# Altium schematic sheet RoomModule.SchDoc
size A4
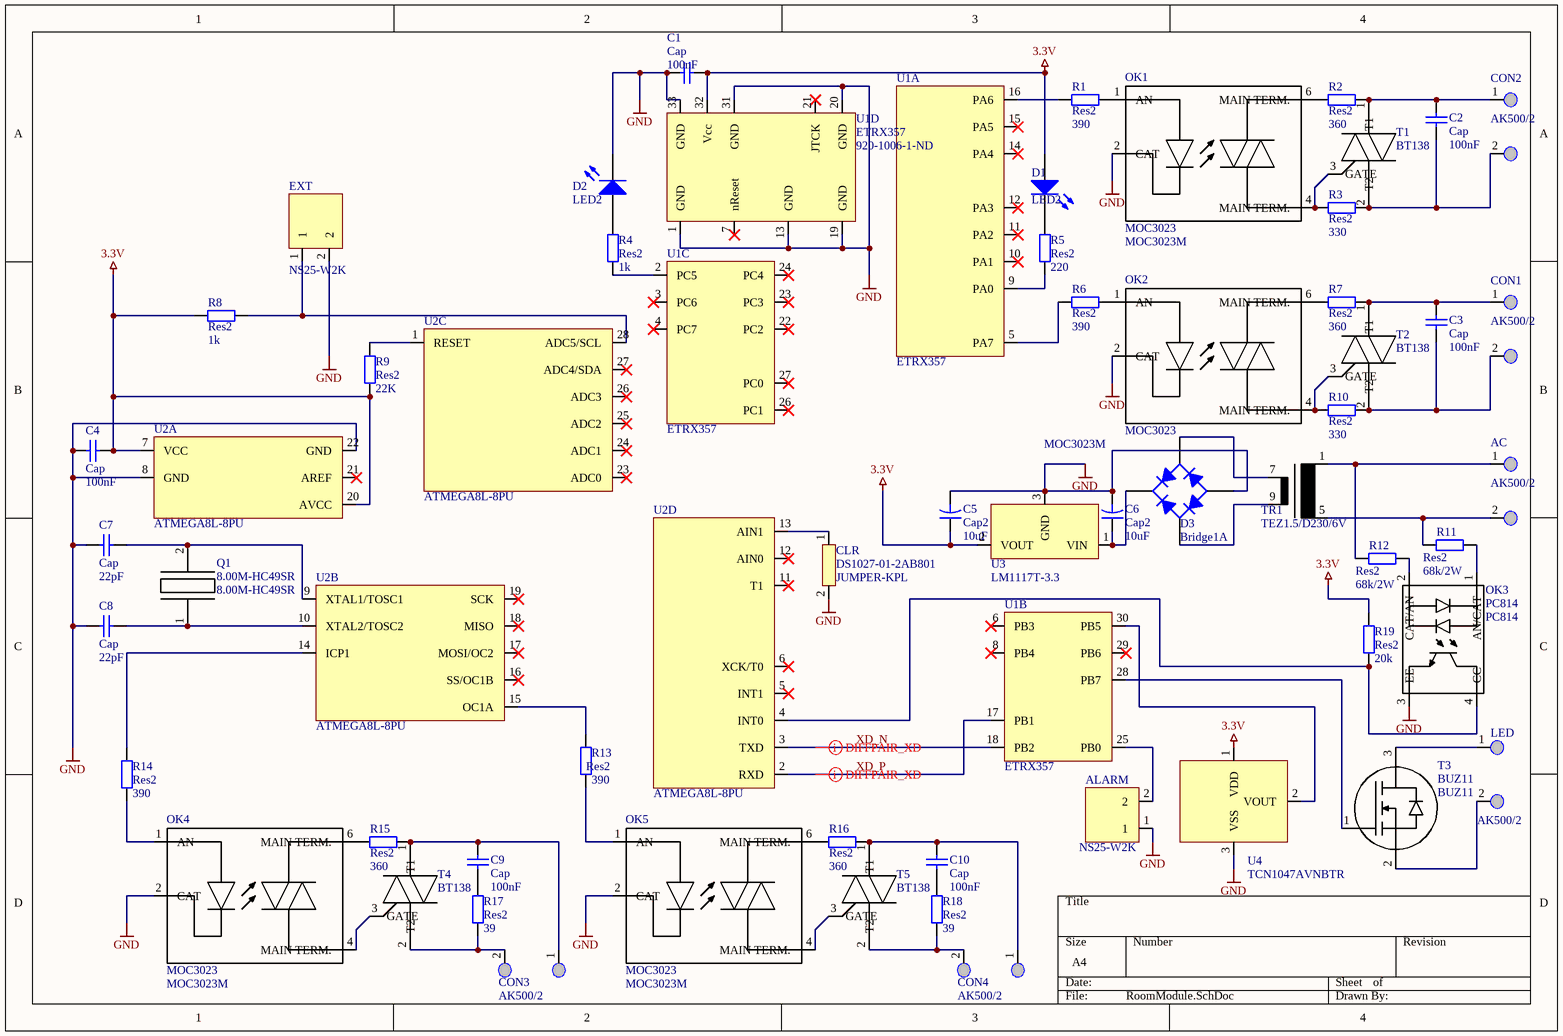
[diagram p0: RoomModule.SchDoc]

## Parts
AC  AK500/2  [AK500/2]
ALARM  NS25-W2K  [NS25-W2K]
C1  Cap  value 100nF  [RAD-0.3]
C2  Cap  value 100nF  [RAD-0.3]
C3  Cap  value 100nF  [RAD-0.3]
C4  Cap  value 100nF  [RAD-0.3]
C5  Cap2  value 10uF  [CAPR5-4X5]
C6  Cap2  value 10uF  [CAPR5-4X5]
C7  Cap  value 22pF  [RAD-0.3]
C8  Cap  value 22pF  [RAD-0.3]
C9  Cap  value 100nF  [RAD-0.3]
C10  Cap  value 100nF  [RAD-0.3]
CLR  DS1027-01-2AB801  Supplier Part Number 1: JUMPER-KPL  [DS1027-01]
CON1  AK500/2  [AK500/2]
CON2  AK500/2  [AK500/2]
CON3  AK500/2  [AK500/2]
CON4  AK500/2  [AK500/2]
D1  LED2  [3.2X1.6X1.1]
D2  LED2  [3.2X1.6X1.1]
D3  Bridge1A  [D-38]
EXT  NS25-W2K  [NS25-W2K]
LED  AK500/2  [AK500/2]
OK1  MOC3023  Supplier Part Number 1: MOC3023M  [DIP6]
OK2  MOC3023  Supplier Part Number 1: MOC3023M  [DIP6]
OK3  PC814  [DIP4]
OK4  MOC3023  Supplier Part Number 1: MOC3023M  [DIP6]
OK5  MOC3023  Supplier Part Number 1: MOC3023M  [DIP6]
Q1  8.00M-HC49SR  [HC49-S]
R1  Res2  value 390  [AXIAL-0.4]
R2  Res2  value 360  [AXIAL-0.4]
R3  Res2  value 330  [AXIAL-0.4]
R4  Res2  value 1k  [AXIAL-0.4]
R5  Res2  value 220  [AXIAL-0.4]
R6  Res2  value 390  [AXIAL-0.4]
R7  Res2  value 360  [AXIAL-0.4]
R8  Res2  value 1k  [AXIAL-0.4]
R9  Res2  value 22K  [AXIAL-0.4]
R10  Res2  value 330  [AXIAL-0.4]
R11  Res2  value 68k/2W  [AXIAL-0.4]
R12  Res2  value 68k/2W  [AXIAL-0.4]
R13  Res2  value 390  [AXIAL-0.4]
R14  Res2  value 390  [AXIAL-0.4]
R15  Res2  value 360  [AXIAL-0.4]
R16  Res2  value 360  [AXIAL-0.4]
R17  Res2  value 39  [AXIAL-0.4]
R18  Res2  value 39  [AXIAL-0.4]
R19  Res2  value 20k  [AXIAL-0.4]
T1  BT138  [TO220AB]
T2  BT138  [TO220AB]
T3  BUZ11  [TO220AB]
T4  BT138  [TO220AB]
T5  BT138  [TO220AB]
TR1  TEZ1.5/D230/6V  [TEZ1.5]
U1  ETRX357  [ETRX3]  (parts A,B,C,D of 4)
U2  ATMEGA8L-8PU  [DIP28_600]  (parts A,B,C,D of 4)
U3  LM1117T-3.3  [TO252]
U4  TCN1047AVNBTR  [SOT23B]

## Nets
3.3V: C1.2 C4.2 C5.1 D1.1(A) R8.2 R9.1 R19.1 U1.32(Vcc) U2.7(VCC) U2.20(AVCC) U3.2(VOUT) U4.1(VDD)
GND: ALARM.1 C1.1 C4.1 C5.2 C6.2 C7.1 C8.1 CLR.2 D2.2(K) D3.3(A) EXT.2 OK1.2(CAT) OK2.2(CAT) OK3.3(EE) OK4.2(CAT) OK5.2(CAT) U1.1(GND) U1.13(GND) U1.19(GND) U1.20(GND) U1.31(GND) U1.33(GND) U2.8(GND) U2.22(GND) U3.3(GND) U4.3(VSS)
XD_N: U1.18(PB2) U2.3(TXD)
XD_P: U1.17(PB1) U2.2(RXD)
NetAC_1: AC.1 R12.2 TR1.1
NetAC_2: AC.2 R11.2 TR1.5
NetALARM_2: ALARM.2 U1.25(PB0)
NetC2_1: C2.1 CON2.2 R3.2 T1.2(T2)
NetC2_2: C2.2 CON2.1 R2.2 T1.1(T1)
NetC3_1: C3.1 CON1.2 R10.2 T2.2(T2)
NetC3_2: C3.2 CON1.1 R7.2 T2.1(T1)
NetC6_1: C6.1 D3.1(K) U3.1(VIN)
NetC7_2: C7.2 Q1.2 U2.9(XTAL1/TOSC1)
NetC8_2: C8.2 Q1.1 U2.10(XTAL2/TOSC2)
NetC9_1: C9.1 R17.1
NetC9_2: C9.2 CON3.1 R15.2 T4.1(T1)
NetC10_1: C10.1 R18.1
NetC10_2: C10.2 CON4.1 R16.2 T5.1(T1)
NetCLR_1: CLR.1 U2.13(AIN1)
NetCON3_2: CON3.2 R17.2 T4.2(T2)
NetCON4_2: CON4.2 R18.2 T5.2(T2)
NetD1_2: D1.2(K) R5.1
NetD2_1: D2.1(A) R4.1
NetD3_2: D3.2(C) TR1.7
NetD3_4: D3.4(C) TR1.9
NetEXT_1: EXT.1 R8.1 U2.28(ADC5/SCL)
NetLED_1: LED.1 T3.3
NetLED_2: LED.2 T3.2
NetOK1_1: OK1.1(AN) R1.2
NetOK1_4: OK1.4(MAIN_TERM.) R3.1 T1.3(GATE)
NetOK1_6: OK1.6(MAIN_TERM.) R2.1
NetOK2_1: OK2.1(AN) R6.2
NetOK2_4: OK2.4(MAIN_TERM.) R10.1 T2.3(GATE)
NetOK2_6: OK2.6(MAIN_TERM.) R7.1
NetOK3_1: OK3.1(AN/CAT) R11.1
NetOK3_2: OK3.2(CAT/AN) R12.1
NetOK3_4: OK3.4(CC) R19.2 U2.4(INT0)
NetOK4_1: OK4.1(AN) R14.2
NetOK4_4: OK4.4(MAIN_TERM.) T4.3(GATE)
NetOK4_6: OK4.6(MAIN_TERM.) R15.1
NetOK5_1: OK5.1(AN) R13.2
NetOK5_4: OK5.4(MAIN_TERM.) T5.3(GATE)
NetOK5_6: OK5.6(MAIN_TERM.) R16.1
NetR1_1: R1.1 U1.16(PA6)
NetR4_2: R4.2 U1.2(PC5)
NetR5_2: R5.2 U1.9(PA0)
NetR6_1: R6.1 U1.5(PA7)
NetR9_2: R9.2 U2.1(RESET)
NetR13_1: R13.1 U2.15(OC1A)
NetR14_1: R14.1 U2.14(ICP1)
NetT3_1: T3.1 U1.28(PB7)
NetU1_30: U1.30(PB5) U4.2(VOUT)

Not connected (* = marked no-connect by the designer): U1 3(PC6)* 4(PC7)* 6(PB3)* 7(nReset)* 8(PB4)* 10(PA1)* 11(PA2)* 12(PA3)* 14(PA4)* 15(PA5)* 21(JTCK)* 22(PC2)* 23(PC3)* 24(PC4)* 26(PC1)* 27(PC0)* 29(PB6)*; U2 5(INT1)* 6(XCK/T0)* 11(T1)* 12(AIN0)* 16(SS/OC1B)* 17(MOSI/OC2)* 18(MISO)* 19(SCK)* 21(AREF)* 23(ADC0)* 24(ADC1)* 25(ADC2)* 26(ADC3)* 27(ADC4/SDA)*

## Layout directives
differential pair: XD_N, XD_P

## Library data of the parts
AC CON1-CON4 LED = AK500/2: AK500/2 connector; HelpURL: http://www.mouser.com/ds/2/16/PCBMETRC-24178.pdf; Supplier 1: Mouser
ALARM EXT = NS25-W2K: 2-pin Right Angle PCB Connector; HelpURL: http://www.tme.eu/pl/Document/f4fbc03349849389d5a444932ab1e0cf/ns25-w2p.pdf; Supplier 1: TME
C1-C4 C7-C10 = Cap: Capacitor; Published: 8-Jun-2000; LatestRevisionDate: 17-Jul-2002; LatestRevisionNote: Re-released for DXP Platform.; PackageReference: RAD-0.3; Publisher: Altium Limited; PackageDescription: Radial Cap, Thru-Hole; 2 Leads; 0.3 in Pin Spacing
C5 C6 = Cap2: Capacitor; Published: 23-Sep-2002; PackageReference: CAPR5-4X5; Publisher: Altium Limited; PackageDescription: Capacitor; 2 Leads
CLR = DS1027-01-2AB801: 2.54 mm jumper; HelpURL: http://www.tme.eu/pl/Document/bc1cc739b5b21bcc5cd54d6b6563701b/ds1027-01.pdf; Supplier 1: TME
D1 D2 = LED2: Typical RED, GREEN, YELLOW, AMBER GaAs LED; Published: 8-Jun-2000; LatestRevisionDate: 17-Jul-2002; LatestRevisionNote: Re-released for DXP Platform.; PackageVersion: Feb-2002; PackageReference: 3.2X1.6X1.1; Publisher: Altium Limited; PackageDescription: SM LED; 2 Flat Leads
D3 = Bridge1: Full Wave Diode Bridge; Published: 8-Jun-2000; LatestRevisionDate: 29-May-2009; LatestRevisionNote: Sch pins A & K swapped.; DatasheetVersion: E2732B; PackageReference: D-38; Publisher: Altium Limited; PackageDescription: Bridge Rectifier; 4 Terminals; Body 9.4 x 9.4 mm (typ); Pitch 5.08 mm
OK1 OK2 OK4 OK5 = MOC3023: 6-Pin DIP Random-Phase Optoisolators Triac Driver Output; HelpURL: http://www.tme.eu/pl/Document/4c07e045ed4ac191018a957800b78b20/MOC3023M.pdf; Supplier 1: TME
OK3 = PC814: 4 pin DIP phototransistor photocoupler; HelpURL: http://www.tme.eu/pl/Document/7c72e8c0af6408fe6ea52e5b893bcefe/EL814.pdf; Supplier 1: TME; Supplier Part Number 1: PC814
Q1 = 8.00M-HC49SR: HC49SR 8 MHz crystal; HelpURL: http://www.tme.eu/pl/Document/efcb5317c1386eb387f1a821507cdec8/hc49_4h.pdf; Supplier 1: TME; Supplier Part Number 1: 8.00M-HC49SR
R1-R19 = Res2: Resistor; Published: 8-Jun-2000; LatestRevisionDate: 17-Jul-2002; LatestRevisionNote: Re-released for DXP Platform.; PackageReference: AXIAL-0.4; Publisher: Altium Limited; PackageDescription: Axial Device, Thru-Hole; 2 Leads; 0.4 in Pin Spacing
T1 T2 T4 T5 = BT138: Passivated triac in a plastic envelope, intended for use in applications requiring high bidirectional transient and blocking voltage capability and high thermal cycling performance.; HelpURL: http://www.tme.eu/pl/Document/de13a3ab15f686af93401a3099e67dbd/BT138_SERIES.pdf; Supplier 1: TME
T3 = BUZ11: N-Channel Power MOSFET 50V, 30A, 40mOhm; HelpURL: http://www.tme.eu/pl/Document/32bcffe6b7dea628ccc11ebc5143910b/BUZ11.pdf; Supplier 1: TME; Supplier Part Number 1: BUZ11
TR1 = TEZ1.5/D230/6V: Transformer for PCB; HelpURL: http://www.tme.eu/pl/Document/539865e675f27153c23510de49b984c9/TEZ-EN.pdf; Supplier 1: TME
U1 = ETRX357: Low power 2.4GHz ZigBee module, based on the latest Ember EM357 single chip ZigBeeTM solution; HelpURL: http://www.telegesis.com/wp-content/uploads/filebase/document-centre/etrx3_technical_manuals/TG-PM-0516-ETRX35x%20r9.pdf; Supplier 1: Digi-Key
U2 = ATMEGA8L-8PU: 8-bit AVR with 8K Bytes In-System Programmable Flash; Supplier 1: TME; HelpURL: http://www.tme.eu/pl/Document/4747295279e62075253e4a5d4db4e737/atmega8_8l.pdf
U3 = LM1117DT-3.3: LDO voltage regulator with 800mA output current and 3.3V fixed voltage; HelpURL: http://www.ti.com/lit/ds/symlink/lm1117-n.pdf; Supplier 1: TME
U4 = TC1047AVNBTR: Precision Temperature-to-Voltage Converter; HelpURL: http://www.tme.eu/pl/Document/7da6a51a09be68bd737cb23438343578/TC1047AVNBTR.pdf; Supplier 1: TME